# Altium schematic sheet [19] - REVISION HISTORY.SchDoc
size A3; DocumentNumber: 2; SheetNumber: 19; SheetTotal: 20
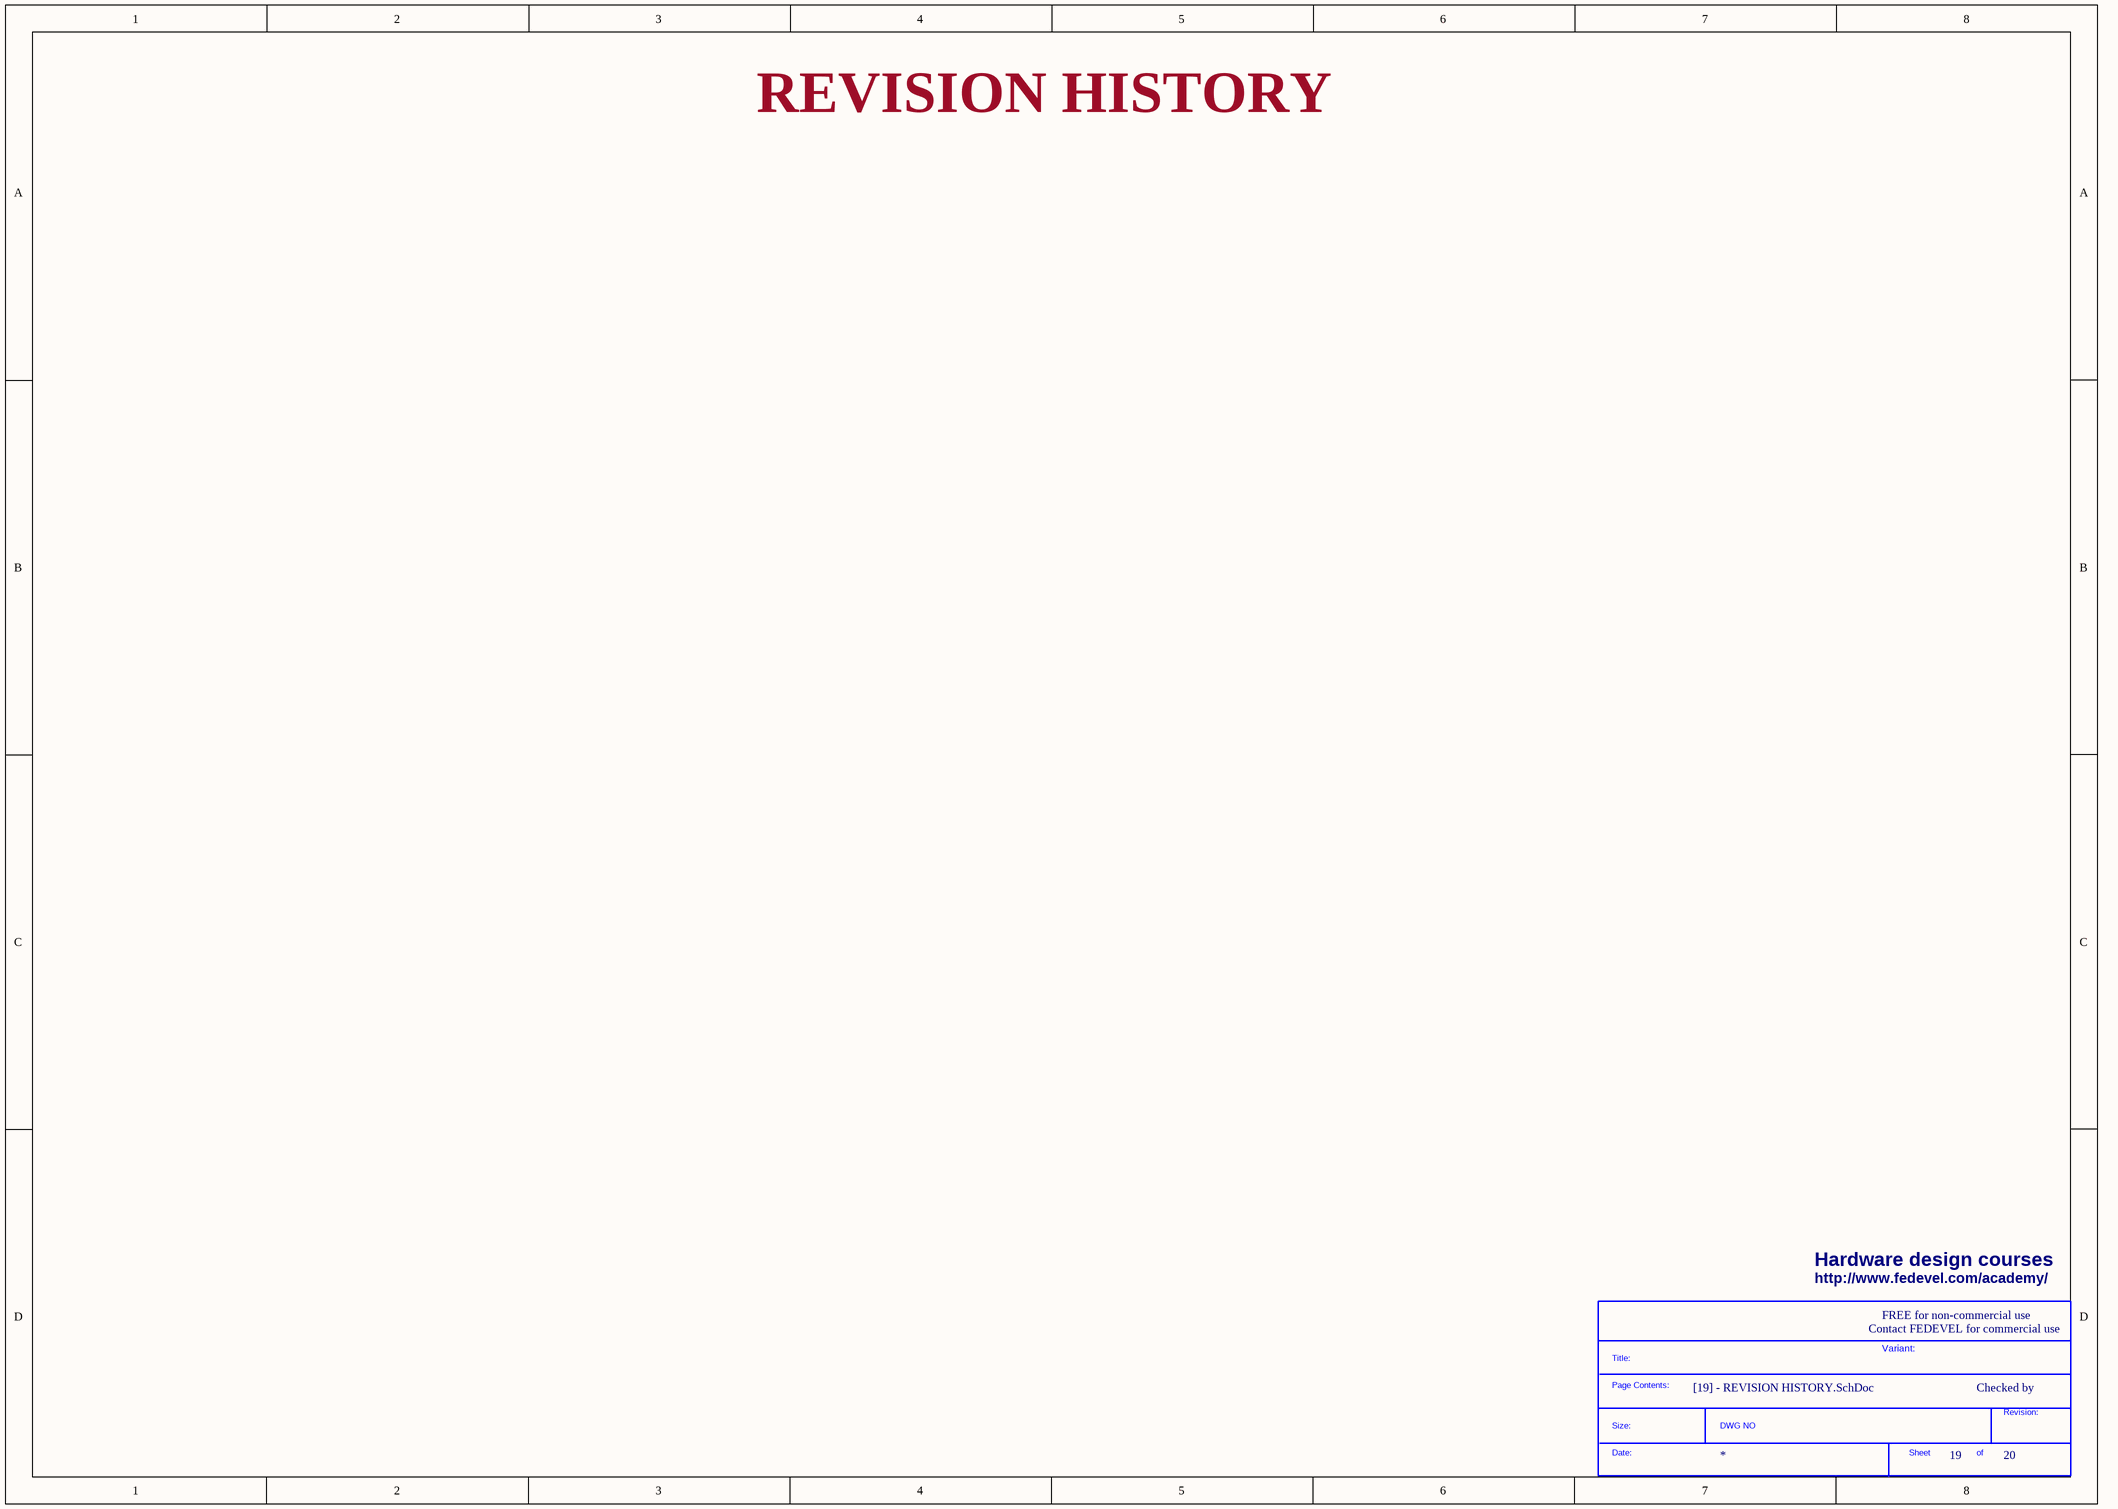
[diagram p0: [19] - REVISION HISTORY.SchDoc]

## Parts
*  SDTitleBlock  (value not drawn)  (graphical)

## Notes on the sheet
- REVISION HISTORY
- Hardware design courses
- http://www.fedevel.com/academy/
- Contact FEDEVEL for commercial use
- FREE for non-commercial use
- Variant:
- Checked by
- (in symbol SDTitleBlock) Title:; Page Contents:; Revision:; Size:; DWG NO; Date:; Sheet; of